# EAGLE design gpio4p2 (EAGLE 7.2.0)
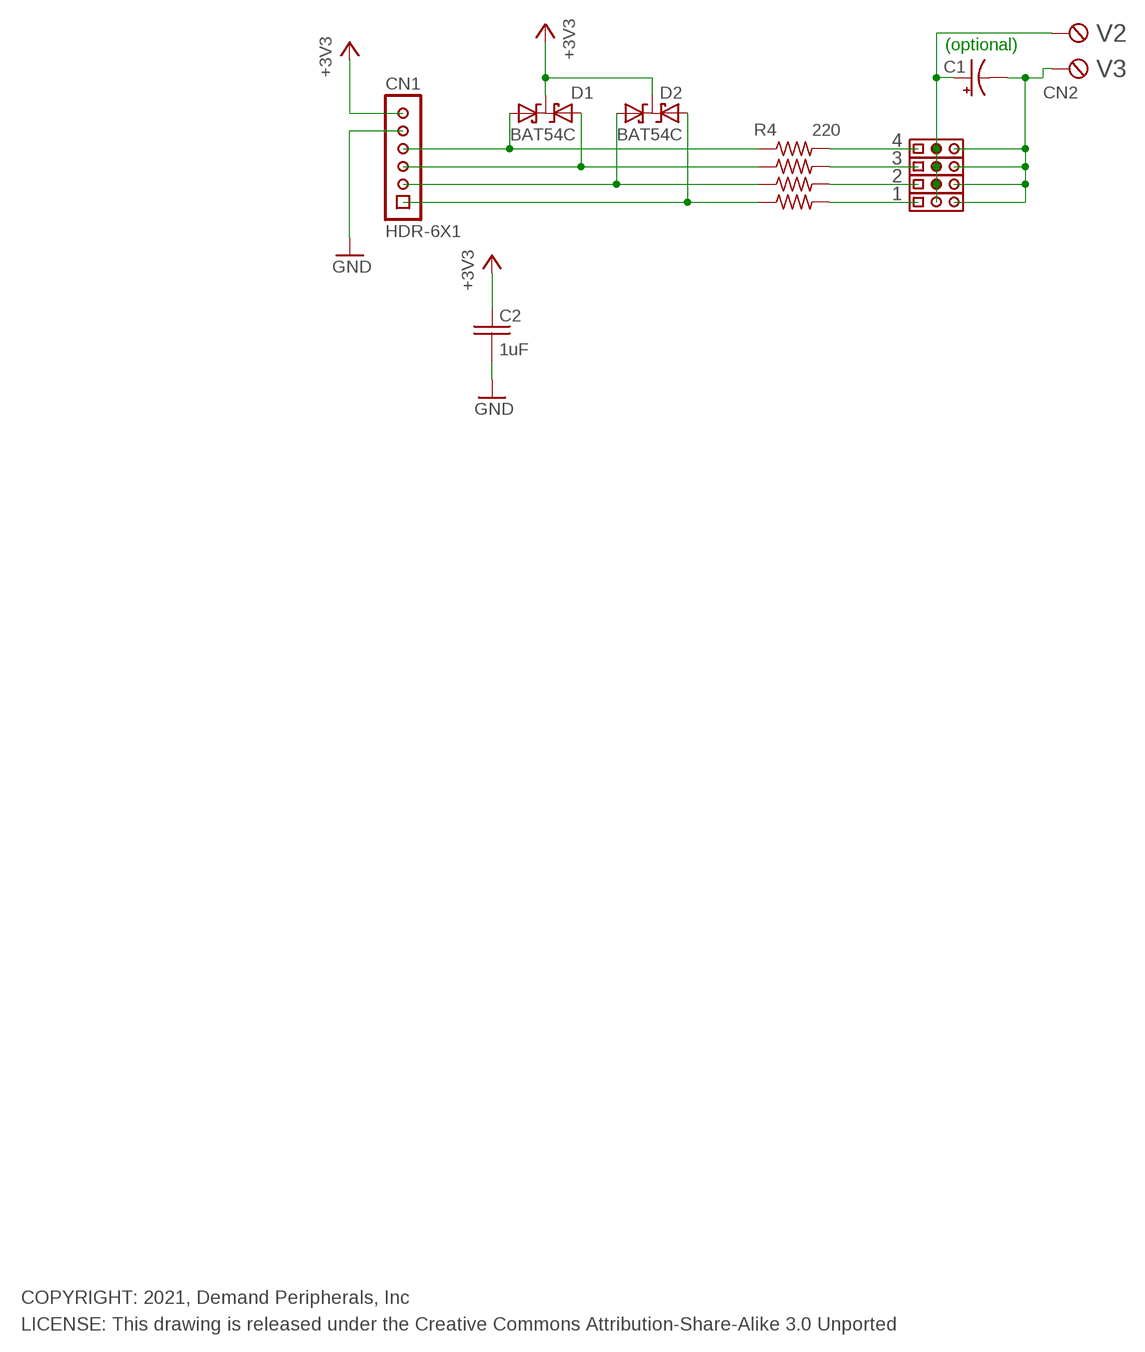
[diagram p0: schematic, sheet 1]

## Parts
C1  100uF  C100UF_E3.5-8  [E3.5-8]
C2  1uF  C1.0UF_C0603  [C0603]
CN1  HDR-6X1  [HDR-6X1]
CN2  TBLK-5.08-X2  [TBLK-5.08-X2]
D1  BAT54C  [SOT23]
D2  BAT54C  [SOT23]
R1  220  R220_R0603  [R0603]
R2  220  R220_R0603  [R0603]
R3  220  R220_R0603  [R0603]
R4  220  R220_R0603  [R0603]
U$5  HDR-3X1  [HDR-3X1]
U$6  HDR-3X1  [HDR-3X1]
U$7  HDR-3X1  [HDR-3X1]
U$9  HDR-3X1  [HDR-3X1]

## Nets
+3V3: C2.1 CN1.6 D1.3(CC) D2.3(CC)
GND: C2.2 CN1.5
N$1: R4.2 U$5.1
N$2: R3.2 U$6.1
N$3: R2.2 U$7.1
N$4: R1.2 U$9.1
N$7: C1.- CN2.1(KL) U$5.3 U$6.3 U$7.3 U$9.3
N$11: CN1.4 D1.2(A) R4.1
N$12: CN1.3 D1.1(A1) R3.1
N$14: CN1.2 D2.2(A) R2.1
N$15: CN1.1 D2.1(A1) R1.1
N$18: C1.+ CN2.2(KL1) U$5.2 U$6.2 U$7.2 U$9.2

## Notes on the sheet
- V2
- (optional)
- V3
- 4
- 3
- 2
- 1
- COPYRIGHT: 2021, Demand Peripherals, Inc
- LICENSE: This drawing is released under the Creative Commons Attribution-Share-Alike 3.0 Unported

## Library data of the parts
C1 = dpi-passive:C100UF_: 100uF polarized capacitor, general purpose; VENDOR: Digikey; VENDOR-PART-NUM: 1572-1044-ND
C2 = dpi-passive:C1.0UF_: 1.0 uF Capacitor, 25V, Y5V; VENDOR: Digikey; VENDOR-PART-NUM: 490-3897-2-ND
CN1 = dpi-conn:HDR-6X1: 6x1 Pin header with pin 1 mark, no shroud, no lock; VENDOR: Digikey; VENDOR-PART-NUM: xxxxxxxxxx-ND
CN2 = dpi-conn:TBLK-5.08-X2: Terminal Block, 5.08mm, x2, screw terminals; VENDOR: Digikey; VENDOR-PART-NUM: ED2609-ND
D1 D2 = dpi-diopto:BAT54C: BAT54C Dual Common Cathode Schottky; VENDOR: Digikey; VENDOR-PART-NUM: DB3X313N0LCT-ND
R1-R4 = dpi-passive:R220_: 220 Ohm resistor, 1%, 0.1 watt; VENDOR: Digikey; VENDOR-PART-NUM: 311-220HRTR-ND
U$5-U$7 U$9 = dpi-conn:HDR-3X1: 3 pin header on 0.1 inch centers, no shroud, no lock; VENDOR: Digikey; VENDOR-PART-NUM: 952-2264-ND

## Board
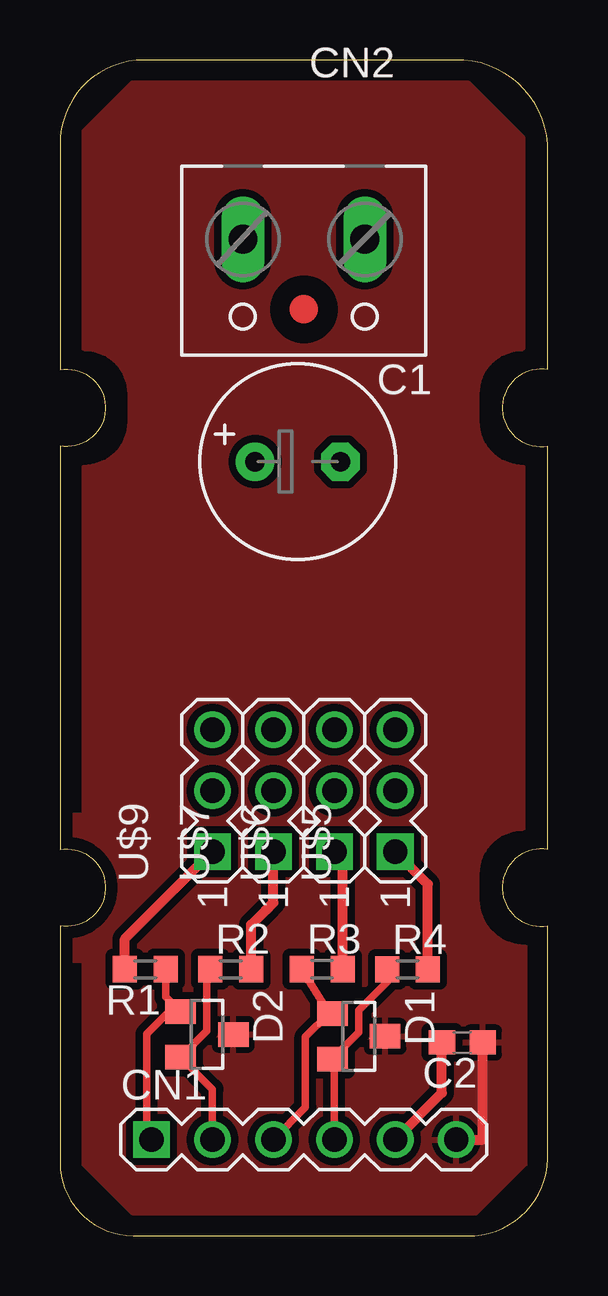
[diagram p1: board, top side]
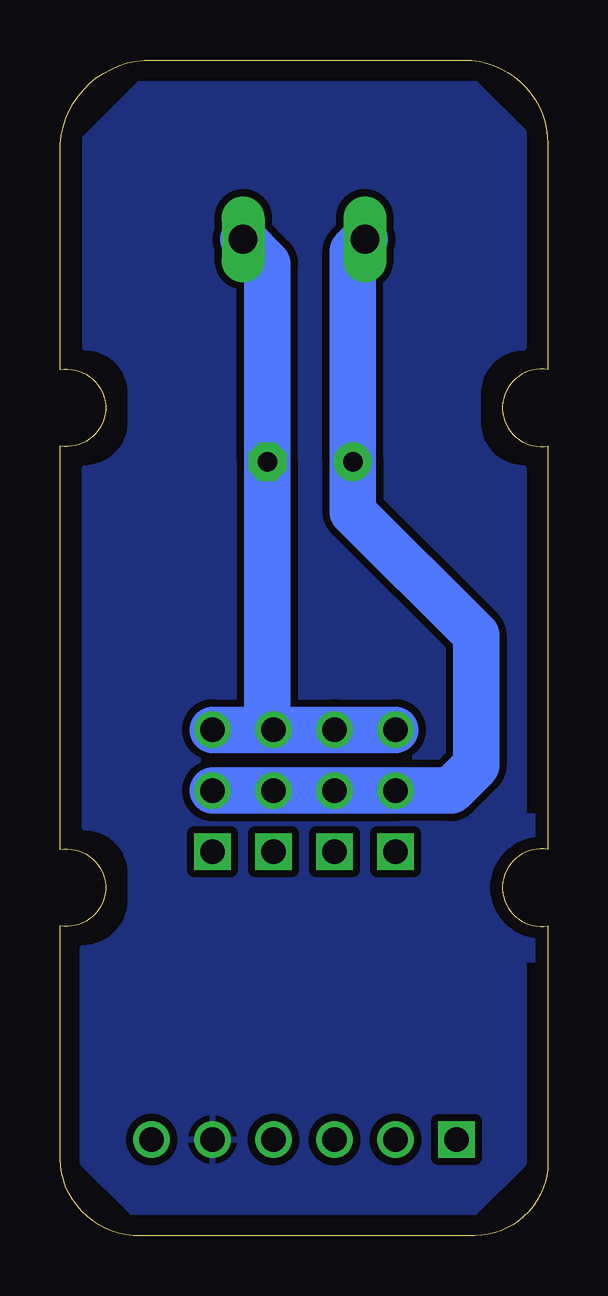
[diagram p2: board, bottom side, seen from below]

Size 20.33 x 49 mm. Coordinates in mm from the lower left corner, seen from the top.
Outline: 20.32,36.09 arc200 20.32,32.91 20.32,16.09 arc200 20.32,12.91 20.32,3.5 arc-90 17.27,0 3.05,0 arc-90 0,3.05 0,12.91 arc200 0,16.09 0,32.91 arc200 0,36.09 0,45.5 arc-90 3.5,49 16.82,49 arc-81 20.32,45.5 20.32,36.09
Copper layers (1*16): Top 0.035mm / dielectric 1.5mm / Bottom 0.035mm
Design rules "default *": minimum track width 10mil, minimum drill 20mil, track to track 12mil, track to pad 12mil, pad to pad 12mil, via to via 12mil, smd to smd 12mil, copper to edge 20mil, drill to drill 8mil, minimum pad ring 10mil, minimum via ring 8mil, stop-mask expansion 4mil, vias tented up to drill 0mil, thermal gap 10mil

### Footprints (pad centres in the part's own frame; a part is rotated, then mirrored left to right if it is on the bottom)
E3.5-8 = drill 0.813 pad 1.6: + -1.778,0 | drill 0.813 pad 1.6 octagon: - 1.778,0
C0603 = smd 1.1 x 1: 1 -0.85,0; 2 0.85,0
HDR-6X1 = drill 1.016 square: 1 -6.35,0 | drill 1.016: 2 -3.81,0; 3 -1.27,0; 4 1.27,0; 5 3.81,0; 6 6.35,0
TBLK-5.08-X2 = drill 1.194 long: 1 -2.54,-0.127; 2 2.54,-0.127
SOT23 = smd 1.016 x 1.27: 1 -0.95,-1.1; 2 0.95,-1.1; 3 0,1.1
R0603 = smd 1 x 1.1: 1 -0.85,0; 2 0.85,0
HDR-3X1 = drill 1.016 square: 1 -2.54,0 | drill 1.016: 2 0,0; 3 2.54,0

### Placement (x,y rotation side)
C1  9.91,32.26 0 top
C2  16.76,8.05 180 top
CN1  10.16,4 0 top
CN2  10.16,41.4 180 top
D1  12.45,8.31 270 top
D2  6.12,8.38 270 top
R1  3.56,11.1 180 top
R2  7.11,11.1 0 top
R3  10.92,11.1 0 top
R4  14.48,11.09 0 top
U$1  [DPI-2]  4.5,44.66 90 top
U$2  DP_FRAME_P  [P_FRAME]  -2.54,-2.54 0 top
U$5  13.97,18.54 90 top
U$6  11.43,18.54 90 top
U$7  8.89,18.54 90 top
U$9  6.35,18.54 90 top
U$15  [FIDUCIAL]  10.16,38.61 270 top

### Tracks (layer width: path | path; a pad name or v marks a point on that pad's centre or on a via)
+3V3
  Top 0.406: CN1.6 17.61,4 C2.1
  pour Top: 1.01,2.99 3.04,0.96 17.32,0.96 19.37,3.01 19.37,12 arc-90 17.37,14 17.37,15.08 arc-90 19.29,17 19.29,32 arc-90 17.37,33.92 17.37,35.09 arc-90 19.28,37 19.28,45.75 17.01,48.02 3.02,48.02 1.01,46.01 1.01,37 arc-90 2.92,35.09 2.92,33.91 arc-90 1.01,32 1.01,17.5 0.55,17.5 0.55,11.5 1,11.5
GND
  Top 0.406: CN1.5 15.91,5.94 C2.2
  pour Bottom: 1.01,2.99 3.04,0.96 17.32,0.96 19.37,3.01 19.37,12 arc-90 17.37,14 17.37,15.08 arc-90 19.29,17 19.29,32 arc-90 17.37,33.92 17.37,35.09 arc-90 19.28,37 19.28,45.75 17.01,48.02 3.02,48.02 1.01,46.01 1.01,37 arc-90 2.92,35.09 2.92,33.91 arc-90 1.01,32 1.01,17.5 0.55,17.5 0.55,11.5 1,11.5
N$1
  Top 0.406: R4.2 15.33,14.64 U$5.1
N$2
  Top 0.406: R3.2 11.77,15.66 U$6.1
N$3
  Top 0.406: R2.2 7.96,12.95 8.57,13.56 8.89,13.88 U$7.1
N$4
  Top 0.406: R1.2 2.71,12.36 U$9.1
N$7
  Bottom 1.93: CN2.1 11.68,40.51 C1.- 11.68,21.34 U$6.3 | U$5.3 U$6.3 | U$6.3 U$7.3 U$9.3
N$11
  Top 0.305: CN1.4 11.43,7.27 D1.2 12.45,8.46 12.44,8.47 12.44,9.38 13.63,10.56 R4.1
N$12
  Top 0.305: CN1.3 10.23,5.34 10.23,8.27 11.21,9.26 | 11.21,9.26 D1.1 | 11.21,9.26 R3.1
N$14
  Top 0.305: CN1.2 6.35,6.1 D2.2 6.12,8.53 6.12,8.96 6.12,10.96 R2.1
N$15
  Top 0.305: CN1.1 3.61,4.2 3.61,8.4 4.53,9.33 D2.1 4.41,9.95 R1.1
N$18
  Bottom 1.93: CN2.2 8.13,41.02 C1.+ 8.13,30.16 2.99,25.02 2.99,19.59 3.47,19.11 4.03,18.54 U$9.2 U$7.2 U$6.2 U$5.2

### Text on the board
tTest: 0.8 in | 20 mm | (C) 2021, Demand Peripherals, Inc. | V2 | V3 | C1 | 20 mm | 49 mm | 1 | 2 | 3 | 4 | GPIO4p2, Rev 21A | V3 | V2 | R2 | R3 | R4 | R1 | C2 | D2 | D1 | CN1